# EAGLE design Adafruit ESP32 Huzzah Breakout (EAGLE 9.2.0)
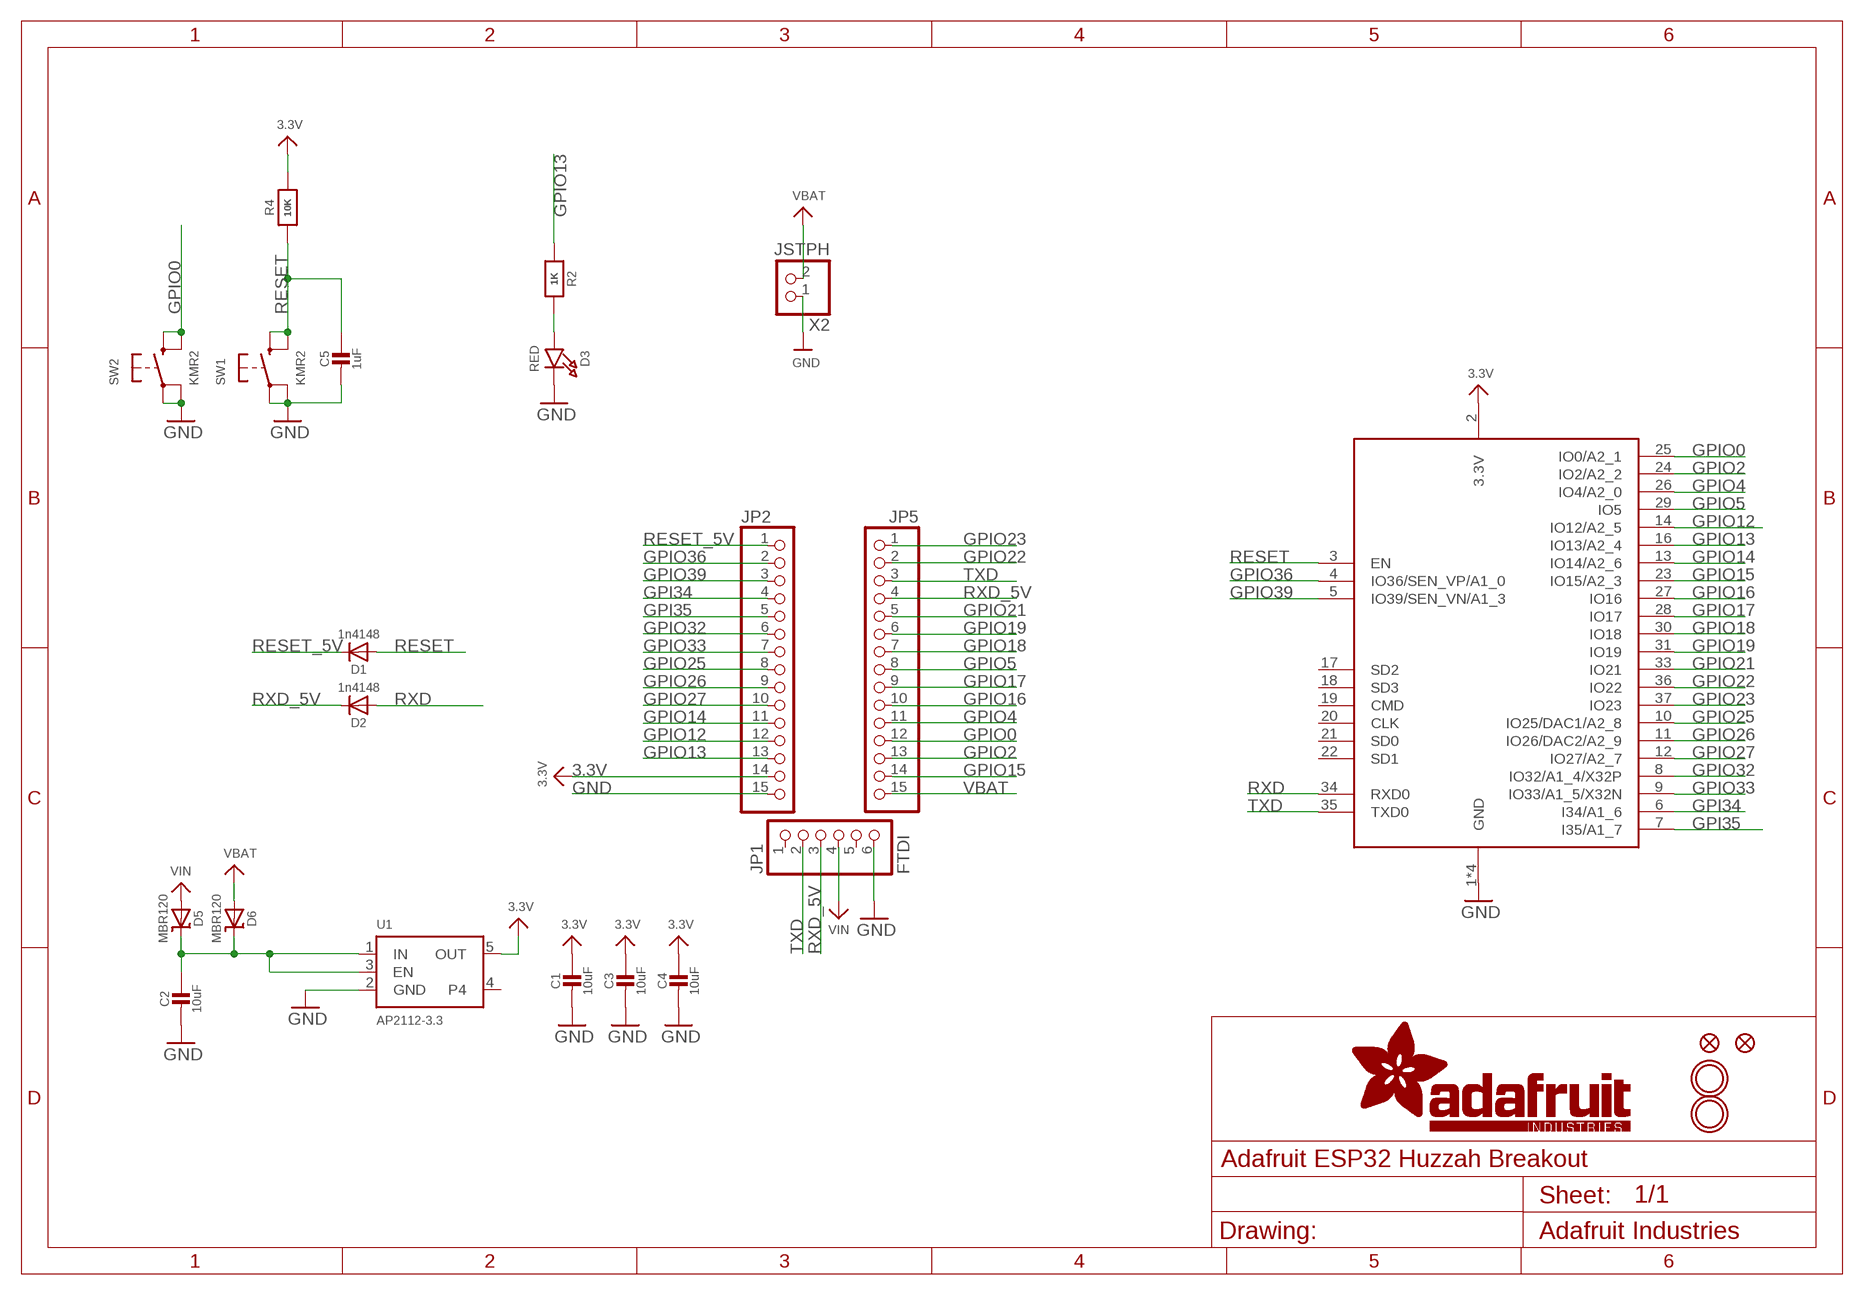
[diagram p0: schematic, sheet 1]

## Parts
C1  10uF  CAP_CERAMIC0805-NOOUTLINE  [0805-NO]
C2  10uF  CAP_CERAMIC0805-NOOUTLINE  [0805-NO]
C3  10uF  CAP_CERAMIC0805-NOOUTLINE  [0805-NO]
C4  10uF  CAP_CERAMIC0805-NOOUTLINE  [0805-NO]
C5  1uF  CAP_CERAMIC0805-NOOUTLINE  [0805-NO]
D1  1n4148  DIODESOD-323  [SOD-323]
D2  1n4148  DIODESOD-323  [SOD-323]
D3  RED  LED0805_NOOUTLINE  [CHIPLED_0805_NOOUTLINE]
D5  MBR120  DIODE-SCHOTTKYSOD-123  [SOD-123]
D6  MBR120  DIODE-SCHOTTKYSOD-123  [SOD-123]
FID1  FIDUCIAL_1MM  [FIDUCIAL_1MM]
FID3  FIDUCIAL_1MM  [FIDUCIAL_1MM]
JP1  FTDI  HEADER-1X670MIL  [1X06_ROUND_70]
JP2  HEADER-1X15  [1X15_ROUND_70]
JP5  HEADER-1X15  [1X15_ROUND_70]
R2  1K  RESISTOR_0603_NOOUT  [0603-NO]
R4  10K  RESISTOR_0603_NOOUT  [0603-NO]
SW1  KMR2  SWITCH_TACT_SMT4.6X2.8  [BTN_KMR2_4.6X2.8]
SW2  KMR2  SWITCH_TACT_SMT4.6X2.8  [BTN_KMR2_4.6X2.8]
U1  AP2112-3.3  VREG_SOT23-5  [SOT23-5]
U$15  MOUNTINGHOLE2.5  [MOUNTINGHOLE_2.5_PLATED]
U$16  MOUNTINGHOLE2.5  [MOUNTINGHOLE_2.5_PLATED]
X1  ESP32_WROOM32  [WROOM32]
X2  JSTPH  CON_JST_PH_2PIN  [JSTPH2]

## Nets
3.3V: C1.1 C3.1 C4.1 JP2.14 R4.2 U1.5(OUT) X1.2(3.3V)
GND: C1.2 C2.2 C3.2 C4.2 C5.2 D3.C JP1.6 JP2.15 SW1.A'(P1) SW1.A(P) SW2.A'(P1) SW2.A(P) U1.2(GND) X1.1(GND) X1.15(GND) X1.38(GND) X1.P$1(GND) X2.1
GPI34: JP2.4 X1.6(I34/A1_6)
GPI35: JP2.5 X1.7(I35/A1_7)
GPIO0: JP5.12 SW2.B'(S1) SW2.B(S) X1.25(IO0/A2_1)
GPIO2: JP5.13 X1.24(IO2/A2_2)
GPIO4: JP5.11 X1.26(IO4/A2_0)
GPIO5: JP5.8 X1.29(IO5)
GPIO12: JP2.12 X1.14(IO12/A2_5)
GPIO13: JP2.13 R2.1 X1.16(IO13/A2_4)
GPIO14: JP2.11 X1.13(IO14/A2_6)
GPIO15: JP5.14 X1.23(IO15/A2_3)
GPIO16: JP5.10 X1.27(IO16)
GPIO17: JP5.9 X1.28(IO17)
GPIO18: JP5.7 X1.30(IO18)
GPIO19: JP5.6 X1.31(IO19)
GPIO21: JP5.5 X1.33(IO21)
GPIO22: JP5.2 X1.36(IO22)
GPIO23: JP5.1 X1.37(IO23)
GPIO25: JP2.8 X1.10(IO25/DAC1/A2_8)
GPIO26: JP2.9 X1.11(IO26/DAC2/A2_9)
GPIO27: JP2.10 X1.12(IO27/A2_7)
GPIO32: JP2.6 X1.8(IO32/A1_4/X32P)
GPIO33: JP2.7 X1.9(IO33/A1_5/X32N)
GPIO36: JP2.2 X1.4(IO36/SEN_VP/A1_0)
GPIO39: JP2.3 X1.5(IO39/SEN_VN/A1_3)
LDO_EN: C2.1 D5.C D6.C U1.1(IN) U1.3(EN)
N$1: D3.A R2.2
RESET: C5.1 D1.A R4.1 SW1.B'(S1) SW1.B(S) X1.3(EN)
RESET_5V: D1.C JP2.1
RXD: D2.A X1.34(RXD0)
RXD_5V: D2.C JP1.3 JP5.4
TXD: JP1.2 JP5.3 X1.35(TXD0)
VBAT: D6.A JP5.15 X2.2
VIN: D5.A JP1.4
Unconnected: JP1.1 JP1.5 U1.4 X1.17(SD2) X1.18(SD3) X1.19(CMD) X1.20(CLK) X1.21(SD0) X1.22(SD1)

## Library data of the parts
C1-C5 = microbuilder:CAP_CERAMIC: Ceramic Capacitors For new designs, use the packages preceded by an '_' character since they are more reliable: The following footprints should be used on most boards: _0402 - Standard footprint for regular board layouts _0603 - Standard footprint for regular board layouts _0805 - Standard footprint for regular board layouts _1206 - Standard footprint for regular board layouts For extremely tight-pitch boards where space is at a premium, the following 'micro-pitch' footprints can be used (smaller pads, no silkscreen outline, etc.): _0402MP - Micro-pitch footprint for very dense/compact boards _0603MP - Micro-pitch footprint for very dense/compact boards _0805MP - Micro-pitch footprint for very dense/compact boards _1206MP - Micro-pitch footprint for very dense/compact boards
D1 D2 = microbuilder:DIODE: Diode SMA Model Volts Amps Type Vf Ir Digikey # Notes SSA34-E3 40V 3A Schottky 480mV @ 3A 200uA @ 40V SSA34-E3/61TGITR-ND CDBA120-G 20V 1A Schottky 500mV @ 1A 500uA @ 20V 641-1014-6-ND REEL MBRA210 10V 2A Schottky 350mV @ 2A 700uA @ 10V MBRA210LT3 SOD-123 Model Volts Amps Type Vf Ir Order # Notes BAT54T1G 30V 200mA Schottky 800mV @ 200mA 2uA @ 25V BAT54T1GOSTR-ND B0530W 30V 500mA Schottky 430mV @ 500mA 130uA @ 30V B0530W-FDICT-ND REEL MBR120 20V 1A Schottky 340mV @ 1A MBR120VLSFT1GOSCT-ND SOD-323 Model Volts Amps Type Vf Ir Order # Notes PMEG2005EJ 20V 500mA Schottky 355mV @ 500mA 568-4110-1-ND ZLLS410 10V 570mA Schottky 380mV @ 570mA ZLLS410CT-ND 1N4148WS 75V 150mA Silicon/Simple 1V 1N4148WSFSCT-ND REEL SOD-523 Model Volts Amps Type Vf Ir Order # Notes BAT54XV2 30V 200mA Schottky 0.8V @ 100mA BAT54XV2CT-ND TB751S 30V 30mA Schottky RB751S-40TE61CT-ND SOT23-R/W (R = Solder Paste/Reflow Ovens, W = Hand-Soldering) Model Volts Amps Type Vf Ir Order # Notes BAT54FILM 40V 300mA Schottky 497-7162-1-ND POWERDI-5 Model Volts Amps Type Vf Ir Order # Notes PDS560 60V 5A Schottky 670mV @ 5A 150uA @ 60V PDS560DICT-ND
D3 = microbuilder:LED: LED 0603 - 0603 Surface Mount Package 2mA: Green LED - Low Power (3.9mcd, 2ma, 1.7Vf) - Digikey: 475-2709-2-ND Orange LED - Low Power (9.8mcd, 2ma, 1.8Vf) - Digikey: 475-1194-2-ND Red LED - Low Power (5mcd, 2ma, 1.8Vf) - Digikey: 475-1195-2-ND Yellow LED - Low Power (7mcd, 2ma, 1.8Vf) - Digikey: 475-1196-2-ND 5mA: Blue LED - Low Power (17mcd, 5ma, 2.9Vf) - Digikey: LNJ937W8CRACT-ND 0805 - 0805 Surface Mount Package 2mA: Red LED (8.8mcd, 2mA, 1.8Vf, Clear) - Low Power [Digikey: 475-2510-1-ND] Green LED (5mcd, 2mA, 1.8Vf, Clear) - Low Power [Digikey: 475-2730-1-ND] Yellow LED (11.3mcd, 2mA, 1.8Vf, Clear) - Low Power [Digikey: 475-2555-1-ND] 20mA: Red LED (104mcd, 20mA, Diffused) - LS R976 [Digikey: 475-1278-6-ND] Red LED (12mcd, 20mA, 2.0Vf, Clear) - APT2012EC [Digikey: 754-1128-1-ND] Green LED (15mcd, 20mA, 2.2Vf, Clear) - APT2012GC [Digikey: 754-1131-1-ND] Orange LED (160mcd, 20mA, 2.1Vf, Clear) - APT2012SECK [Digikey: 754-1130-1-ND] 1206 - 1206 Surface Mount Package Green LED (26mcd, 20mA, Diffused) - LG N971 [Digikey: 475-1407-6-ND] Red LED (15mcd, 20mA, Diffused) - LH N974 [Digikey: 475-1416-6-ND] Cree - Cree High-Power Surface Mount LEDs XPEBWT-L1-0000-00D50 - White 111lm 350mA 2.9Vf 6200K 110° XTEAWT-00-0000-00000LEE3 - White 114lm 350mA 2.85Vf 5000K 115° Everlight - Everlight 45-21 Series Surface Mount LEDs 45-21/QK2C-B2832AC2CB2/2T - Warm White 2000mcd 20mA 3.25Vf 3050K 120° 45-21/LK2C-B38452C4CB2/2T - Nuetral White 2000mcd 20mA 3.25Vf 4150K 120° 45-21/LK2C-B50634C6CB2/2T - Cold White 2200mcd 20mA 3.25Vf 5650K 120° PLCC2 Reverse Mount LS T77K-J1L2-1-0-2-R18-Z - Red 11.25mcd 2mA 1.8Vf 630nm 120° LO T77K-L1M2-24-Z - Orange 19.6mcd 2mA 1.8Vf 606nm 120° LY T77K-K2M1-26-Z - Yellow 15.7mcd 2mA 1.8Vf 587nm 120°
D5 D6 = microbuilder:DIODE-SCHOTTKY
FID1 FID3 = microbuilder:FIDUCIAL: Fiducial Alignment Points Various fiducial points for machine vision alignment.; BOM: EXCLUDE
JP1 = microbuilder:HEADER-1X6: PIN HEADER
JP2 JP5 = microbuilder:HEADER-1X15: 1x15 Header
R2 R4 = microbuilder:RESISTOR: Resistors For new designs, use the packages preceded by an '_' character since they are more reliable: The following footprints should be used on most boards: _0402 - Standard footprint for regular board layouts _0603 - Standard footprint for regular board layouts _0805 - Standard footprint for regular board layouts _1206 - Standard footprint for regular board layouts For extremely tight-pitch boards where space is at a premium, the following 'micro-pitch' footprints can be used (smaller pads, no silkscreen outline, etc.): _0402MP - Micro-pitch footprint for very dense/compact boards _0603MP - Micro-pitch footprint for very dense/compact boards _0805MP - Micro-pitch footprint for very dense/compact boards _1206MP - Micro-pitch footprint for very dense/compact boards
SW1 SW2 = microbuilder:SWITCH_TACT_SMT: SMT Tact Switches 6x6mm - Digikey: P12940SCT-ND KMR2 (4.6x2.8mm) - Digikey: 401-1426-1-ND EVQ-PQHB55 - Light Touch, 160GF (4.5x4.5mm) - Digikey: P8090SCT-ND KMT0 - KMT021 NGJ LHS (etc.) IP68/Waterproof - Digikey: CKN10289CT-ND
U1 = microbuilder:VREG_SOT23-5: SOT23-5 Fixed Voltage Regulators Part Current Out V Out V In V Dropout θJA (°C/W) TJ (°C) Digikey Part No. ADP121 150mA 3.3V 3.4-5.5V 0.09V @ 150mA -- -- ADP121-AUJZ33R7CT-ND ADP121 150mA 3.0V 3.1-5.5V 0.09V @ 150mA -- -- ADP121-AUJZ30R7CT-ND ADP122 300mA 3.3V 3.4-5.5V 0.085V @ 300mA -- -- ADP122AUJZ-3.3-R7CT-ND ADP1712 300mA 3.3V 3.5-5.5V 0.17V @ 300mA -- -- ADP1712AUJZ-3.3-R7TR-ND AP7311 (Low Cost) 150mA 3.3V 3.5-6V 0.15V @ 150mA -- -- AP7311-33WG-7DICT-ND LD39015M18R 150mA 1.8V 1.9V-5.5V 0.08V @ 100mA -- -- 497-6977-1-ND LP2985A-33DBVR 150mA 3.3V 3.3-16V 0.28V @ 150mA 206 150 296-18479-1-ND MCP1824T-3302E/OT 300mA 3.3V 3.5V-6V 0.2V @ 300mA -- -- MCP1824T-3302E/OTCT-ND MIC5205-2.5YM5 TR 150mA 2.5V 2.7-16V 0.165V @ 150mA -- -- 576-1257-2-ND MIC5205-3.0YM5 TR 150mA 3.0V 3.2V-16V 0.165V @ 150mA -- -- 576-1258-2-ND MIC5205-3.3YM5 TR 150mA 3.3V 3.5V-16V 0.165V @ 150mA -- -- 576-1259-2-ND TPS780330220 150mA 3.3V+2.2V 3.6-5.5V 250mV Max -- -- 296-23332-1-ND TDA3663/N1,135 100mA 3.3V 3.5-45V 0.18V @ 50mA -- -- 568-5343-1-ND Max operating temp can be calculated using θJA, TJ (max junction temperature), and power in watts. Set the "Maximum Ambient Temperature" until it reaches TJ ("Max Junction Temperature"), which is the absolute limit for safe use of the regulator: Heat Sink Temperature Calculator <http://www.daycounter.com/Calculators/Heat-Sink-Temperature-Calculator.phtml> For example, With 12V source into a 3.3V LP2985 and a 30mA load, we are dissipating (12V-3.3V) * 0.03A = 0.261W. With a θJA of 206 °C/W, a TJ of 150°C, and 261mW we can safely use the chip without a heat sink up to 75°C (=147.1°C Junction Temperature).
U$15 U$16 = microbuilder:MOUNTINGHOLE: Mounting Hole For #2 screws (0.086"/2.18mm width, 0.094"/2.4mm hole) use 2.5mm; BOM: EXCLUDE
X1 = microbuilder:ESP32_WROOM32
X2 = microbuilder:CON_JST_PH_2PIN: JST 2-Pin Right-Angle Connector PH-Series - 4UConnector: 17311 SH-Series - 4UConnector: 07278

## Board
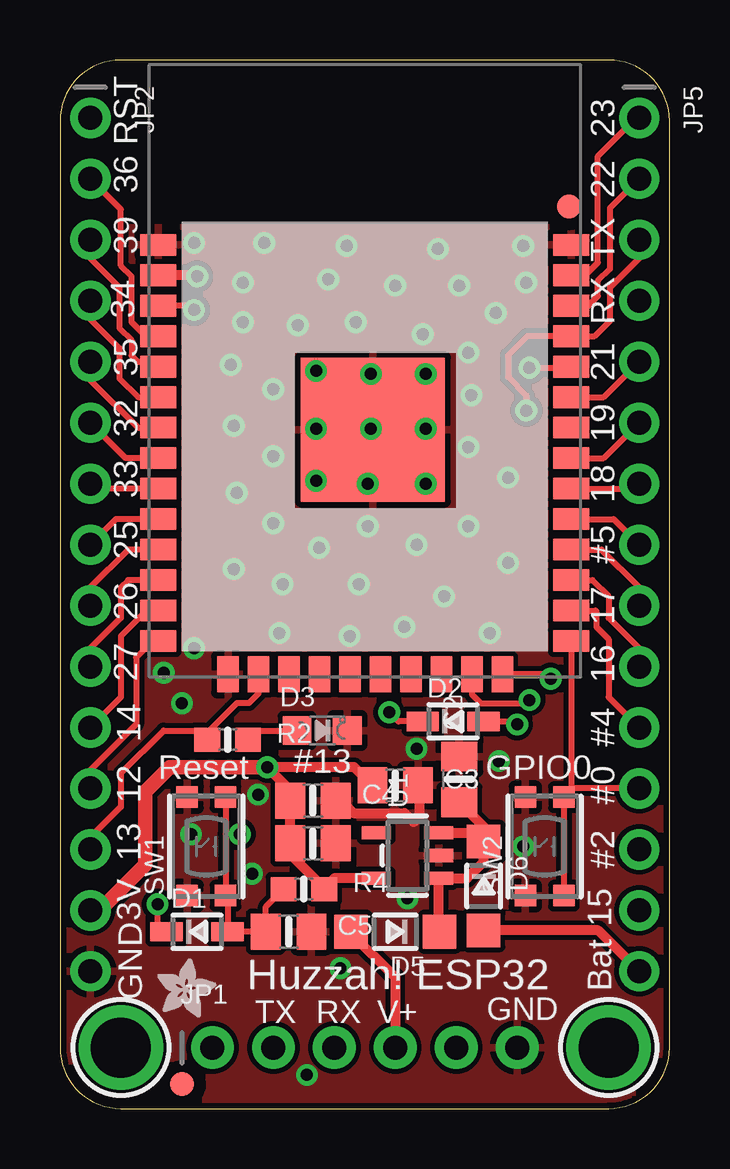
[diagram p1: board, top side]
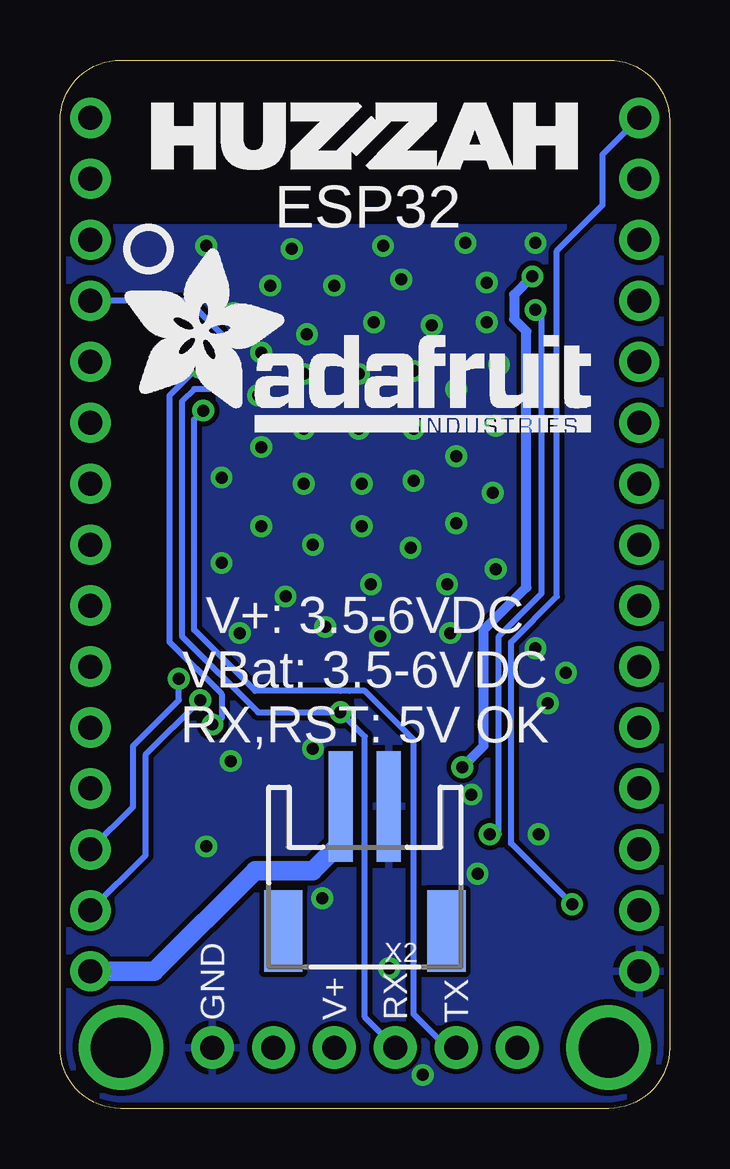
[diagram p2: board, bottom side, seen from below]

Size 25.4 x 43.69 mm. Coordinates in mm from the lower left corner, seen from the top.
Outline: 0,41.15 0,2.54 arc90 2.54,0 22.86,0 arc90 25.4,2.54 25.4,41.15 arc90 22.86,43.69 2.54,43.69 arc90 0,41.15
Copper layers (1*16): Top 0.035mm / dielectric 1.5mm / Bottom 0.035mm
Design rules "adafruit *": minimum track width 10mil, minimum drill 15.5mil, track to track 8mil, track to pad 8mil, pad to pad 8mil, via to via 8mil, smd to smd 8mil, copper to edge 10mil, drill to drill 8mil, minimum pad ring 10mil, minimum via ring 8mil, stop-mask expansion 2mil, vias tented up to drill 20mil, thermal gap 10mil

### Footprints (pad centres in the part's own frame; a part is rotated, then mirrored left to right if it is on the bottom)
0805-NO = smd 1.24 x 1.5: 1 -0.95,0; 2 0.95,0
SOD-323 = smd 1.35 x 0.8: A 1.27,0; C -1.27,0
CHIPLED_0805_NOOUTLINE = smd 1.2 x 1.2: A 0,-1.05; C 0,1.05
SOD-123 = smd 1.4 x 1.4: A 1.85,0; C -1.85,0
FIDUCIAL_1MM = smd 1 x 1: 1 0,0
1X06_ROUND_70 = drill 1 pad 1.778: 1 -6.35,0; 2 -3.81,0; 3 -1.27,0; 4 1.27,0; 5 3.81,0; 6 6.35,0
1X15_ROUND_70 = drill 1 pad 1.676: 1 -17.78,0; 2 -15.24,0; 3 -12.7,0; 4 -10.16,0; 5 -7.62,0; 6 -5.08,0; 7 -2.54,0; 8 0,0; 9 2.54,0; 10 5.08,0; 11 7.62,0; 12 10.16,0; 13 12.7,0; 14 15.24,0; 15 17.78,0
0603-NO = smd 1.075 x 1: 1 -0.85,0; 2 0.85,0
BTN_KMR2_4.6X2.8 = smd 0.9 x 0.9: A 2.05,0.8; A' -2.05,0.8; B 2.05,-0.8; B' -2.05,-0.8
SOT23-5 = smd 0.55 x 1.2: 1 -0.95,-1.3; 2 0,-1.3; 3 0.95,-1.3; 4 0.95,1.3; 5 -0.95,1.3
MOUNTINGHOLE_2.5_PLATED = drill 2.5 pad 3.2: P$1 0,0
WROOM32 = smd 1.5 x 0.9: 1 -8.6,5; 2 -8.6,3.73; 3 -8.6,2.46; 4 -8.6,1.19; 5 -8.6,-0.08; 6 -8.6,-1.35; 7 -8.6,-2.62; 8 -8.6,-3.89; 9 -8.6,-5.16; 10 -8.6,-6.43; 11 -8.6,-7.7; 12 -8.6,-8.97; 13 -8.6,-10.24; 14 -8.6,-11.51; 25 8.6,-11.51; 26 8.6,-10.24; 27 8.6,-8.97; 28 8.6,-7.7; 29 8.6,-6.43; 30 8.6,-5.16; 31 8.6,-3.89; 32 8.6,-2.62; 33 8.6,-1.35; 34 8.6,-0.08; 35 8.6,1.19; 36 8.6,2.46; 37 8.6,3.73; 38 8.6,5 | smd 0.9 x 1.5: 15 -5.7,-12.9; 16 -4.43,-12.9; 17 -3.16,-12.9; 18 -1.89,-12.9; 19 -0.62,-12.9; 20 0.65,-12.9; 21 1.92,-12.9; 22 3.19,-12.9; 23 4.46,-12.9; 24 5.73,-12.9 | smd 6 x 6: P$1 0.34,-2.7
JSTPH2 = smd 1 x 4.6: 1 -1,-3.7; 2 1,-3.7 | smd 1.6 x 3.4: NC1 -3.4,1.5; NC2 3.4,1.5

### Placement (x,y rotation side)
C1  10.54,11.05 0 top
C2  16.64,13.72 90 top
C3  13.97,13.46 0 top
C4  10.54,12.83 0 top
C5  9.53,7.37 0 top
D1  5.71,7.37 0 top
D2  16.38,16.13 0 top
D3  10.92,15.75 270 top
D5  13.97,7.37 180 top
D6  17.65,9.27 270 top
FID1  21.21,37.59 0 top
FID3  5.08,1.02 0 top
JP1  12.7,2.54 0 top
JP2  1.27,23.5 270 top
JP5  24.13,23.5 270 top
R2  6.99,15.37 0 top
R4  10.16,9.14 0 top
SW1  6.1,10.92 90 top
SW2  20.19,10.92 90 top
U1  14.48,10.54 90 top
U$2  [HUZZAHLOGO]  21.59,39.12 0 bottom
U$3  [ADAFRUIT_2.5MM]  4.06,3.81 0 top
U$12  [ADAFRUIT_TEXT_20MM]  22.86,28.19 0 bottom
U$13  [PCBFEAT-REV-040]  21.72,35.81 0 bottom
U$15  2.54,2.54 0 top
U$16  22.86,2.54 0 top
X1  12.7,30.99 0 top
X2  12.7,8.89 180 bottom

### Tracks (layer width: path | path; a pad name or v marks a point on that pad's centre or on a via)
3.3V  (via drill 0.5)
  Top 0.254: C1.1
  Top 0.406: v5.71,34.67 5.67,34.72 X1.2 | C3.1 12.26,14.22 v8.64,14.22 9.59,13.27 C4.1 C1.1 9.59,10.6 11.01,9.18 | 11.01,9.18 R4.2 | U1.5 11.42,9.59 11.01,9.18
  Top 0.61: JP2.14 1.65,8.26 3.56,10.16 3.56,13.21 4.57,14.22 v8.64,14.22
  Bottom 0.406: v8.64,14.22 7.75,15.11 7.75,19.94 5.97,21.72 5.97,32.38 6.48,32.89 6.48,33.91 v5.71,34.67
GND  (via drill 0.5)
  Top 0.406: C4.2 11.71,12.83 12.23,12.31 14.36,12.31 14.73,11.94 14.99,12.19 14.99,13.4 C3.2
  other vias: 19.3,10.92 14.86,14.99 18.29,14.48 10.29,1.4 8.26,13.08 14.48,8.76 5.46,11.43 9.14,19.81 12.06,19.68 12.45,21.84 7.24,28.45 8.89,27.18 17.02,31.5 18.67,26.29 18.16,33.15 15.11,32.26 19.43,34.42 19.3,35.94 15.75,35.81 11.94,35.94 8.51,36.07 5.59,36.07 7.62,34.42 7.62,32.77 7.37,25.65 13.97,34.29 16.64,34.29 5.08,16.89 4.32,18.16 5.59,19.18 8,9.78 18.67,22.73 16,21.34 10.67,30.73 10.67,28.32 10.67,26.16 12.83,26.04 15.24,26.04 15.24,28.32 15.24,30.61 12.95,30.61 12.95,28.32 17.91,19.81 7.24,22.48 8.89,24.38 12.83,24.26 10.79,23.37 9.27,21.84 11.18,34.54 17.02,24.26 17.02,27.56 12.32,32.77 17.14,29.72 14.35,20.07 14.86,23.5 9.91,32.64 8.89,29.97 7.11,30.99 11.68,5.84
  pour Top: 0,0 0.13,36.7 25.53,36.7 25.4,0
  pour Bottom: 0,0 0,36.7 25.4,36.7 25.4,0
GPI34
  Top 0.254: JP2.4 1.27,32.89 2.48,31.69 2.48,30.42 3.25,29.64 X1.6
GPI35
  Top 0.254: JP2.5 1.27,30.35 3.25,28.37 X1.7
GPIO0
  Top 0.254: JP5.12 21.36,13.34 SW2.B | SW2.B SW2.B' | X1.25 21.3,13.28 SW2.B
GPIO2  (via drill 0.5)
  Top 0.254: v20.45,17.91 20.27,18.09 X1.24
  Bottom 0.254: JP5.13 22.35,12.57 22.35,15.11 20.45,17.02 v20.45,17.91
GPIO4
  Top 0.254: X1.26 22.3,20.75 22.35,20.7 22.35,20.07 22.86,19.56 22.86,17.14 JP5.11
GPIO5
  Top 0.254: X1.29 23.07,24.56 JP5.8
GPIO12
  Top 0.254: X1.14 3.86,19.48 3.17,18.8 3.17,16 1.27,14.1 JP2.12
GPIO13
  Top 0.254: X1.16 8.27,17.29 7.87,16.89 7.37,16.89 6.22,15.75 | 6.22,15.75 4.32,15.75 2.54,13.97 2.54,12.57 1.27,11.3 JP2.13 | 6.22,15.75 6.52,15.75 | R2.1 6.13,15.66 6.22,15.75
GPIO14
  Top 0.254: X1.13 3.6,20.75 2.54,19.68 2.54,17.14 JP2.11
GPIO15  (via drill 0.5)
  Top 0.254: X1.23 17.16,17.26 17.53,16.89 19.43,16.89 v19.56,17.02
  Bottom 0.254: JP5.14 21.84,10.54 21.84,14.73 v19.56,17.02
GPIO16
  Top 0.254: X1.27 22.18,22.02 22.86,21.34 22.86,20.45 24.13,19.18 JP5.10
GPIO17
  Top 0.254: X1.28 22.56,23.29 24.13,21.72 JP5.9
GPIO18
  Top 0.254: X1.30 23.92,25.83 JP5.7
GPIO19
  Top 0.254: X1.31 22.65,27.1 JP5.6
GPIO21
  Top 0.254: X1.33 22.65,29.64 JP5.5
GPIO22
  Top 0.254: X1.36 22.02,33.45 22.42,33.85 22.42,34.48 22.92,34.99 22.92,37.53 JP5.2
GPIO23
  Top 0.254: X1.37 21.89,34.72 22.42,35.24 22.42,39.69 24,41.27 JP5.1
GPIO25
  Top 0.254: X1.10 2.33,24.56 JP2.8
GPIO26
  Top 0.254: X1.11 2.84,23.29 1.27,21.72 JP2.9
GPIO27
  Top 0.254: X1.12 2.84,22.02 2.54,21.72 2.54,20.45 1.27,19.18 JP2.10
GPIO32
  Top 0.254: X1.8 2.75,27.1 JP2.6
GPIO33
  Top 0.254: X1.9 1.48,25.83 JP2.7
GPIO36
  Top 0.254: X1.4 3.57,32.18 2.98,32.77 2.98,34.67 2.54,35.12 2.54,37.47 JP2.2
GPIO39
  Top 0.254: JP2.3 1.27,35.43 2.48,34.23 2.48,32.51 2.98,32 2.98,31.37 3.24,31.11 3.89,31.11 X1.5
LDO_EN
  Top 0.406: C2.1 17.65,11.75 17.65,11.3 | 17.65,11.3 D6.C 17.65,10.29 16.96,9.59 U1.1 15.78,7.41 D5.C | U1.3 17.46,11.49 17.65,11.3
N$1
  Top 0.254: D3.A 8.22,15.75 R2.2
RESET  (via drill 0.5)
  Top 0.254: SW1.B 6.9,11.43 | 6.9,11.43 SW1.B' 6.99,8.78 D1.A C5.1 8.57,8.41 R4.1 | 6.9,11.43 v7.49,11.43 | v5.59,33.27 5.41,33.45 X1.3
  Bottom 0.254: v7.49,11.43 7.11,11.43 7.11,19.68 5.33,21.46 5.33,33.02 v5.59,33.27
RESET_5V  (via drill 0.5)
  Top 0.254: D1.C 4.06,7.75 v4.06,8.51
  Bottom 0.254: v4.06,8.51 6.6,11.05 6.6,19.43 4.7,21.34 4.7,35.75 2.79,37.66 2.79,39.75 JP2.1
RXD  (via drill 0.5)
  Top 0.254: v19.56,30.86 21.25,30.86 X1.34 | D2.A 18.92,16.13 v19.05,16
  Bottom 0.254: v19.56,30.86 19.68,30.86 20.83,29.72 20.83,19.43 18.67,17.27 18.67,16.26 18.92,16 v19.05,16
RXD_5V  (via drill 0.5)
  Top 0.254: D2.C 14.1,16.13 v13.72,16.51
  Bottom 0.254: JP5.4 20.07,33.66 18.67,32.26 18.67,30.48 19.18,29.97 19.81,29.97 20.32,29.46 20.32,19.68 17.14,16.51 v13.72,16.51 12.7,15.49 12.7,3.81 JP1.3
TXD  (via drill 0.5)
  Top 0.254: JP5.3 24.13,35.43 22.92,34.23 22.92,32.83 22.27,32.18 X1.35 19.48,32.18 18.67,31.37 18.67,30.48 19.43,29.72 v19.43,29.08
  Bottom 0.254: JP1.2 9.27,2.54 10.67,3.94 10.67,15.37 12.7,17.4 13.34,17.4 13.72,17.4 17.27,17.4 19.81,19.94 19.81,28.7 v19.43,29.08
VBAT
  Top 0.406: JP5.15 22.42,7.42 D6.A
  Bottom 0.813: X2.2 13.7,11.06 14.86,9.91 17.27,9.91 21.46,5.71 JP5.15
VIN
  Top 0.406: JP1.4 13.97,5.46 12.12,7.31 D5.A

### Text on the board
tPlace: RST | 23 | 36 | 22 | 39 | TX | 34 | RX | 35 | 21 | 32 | 19 | 33 | 18 | 25 | #5 | 26 | 17 | 27 | 16 | 14 | #4 | 12 | Reset | #13 | GPIO0 | #0 | 13 | #2 | 3V | 15 | GND | Huzzah! ESP32 | Bat | TX | RX | V+ | GND
bPlace: ESP32 | V+: 3.5-6VDC / VBat: 3.5-6VDC / RX,RST: 5V OK | TX | RX | V+ | GND